# EAGLE schematic mdu29 (EAGLE 8.6.0)

## Sheet 1 of 2: logic circuit
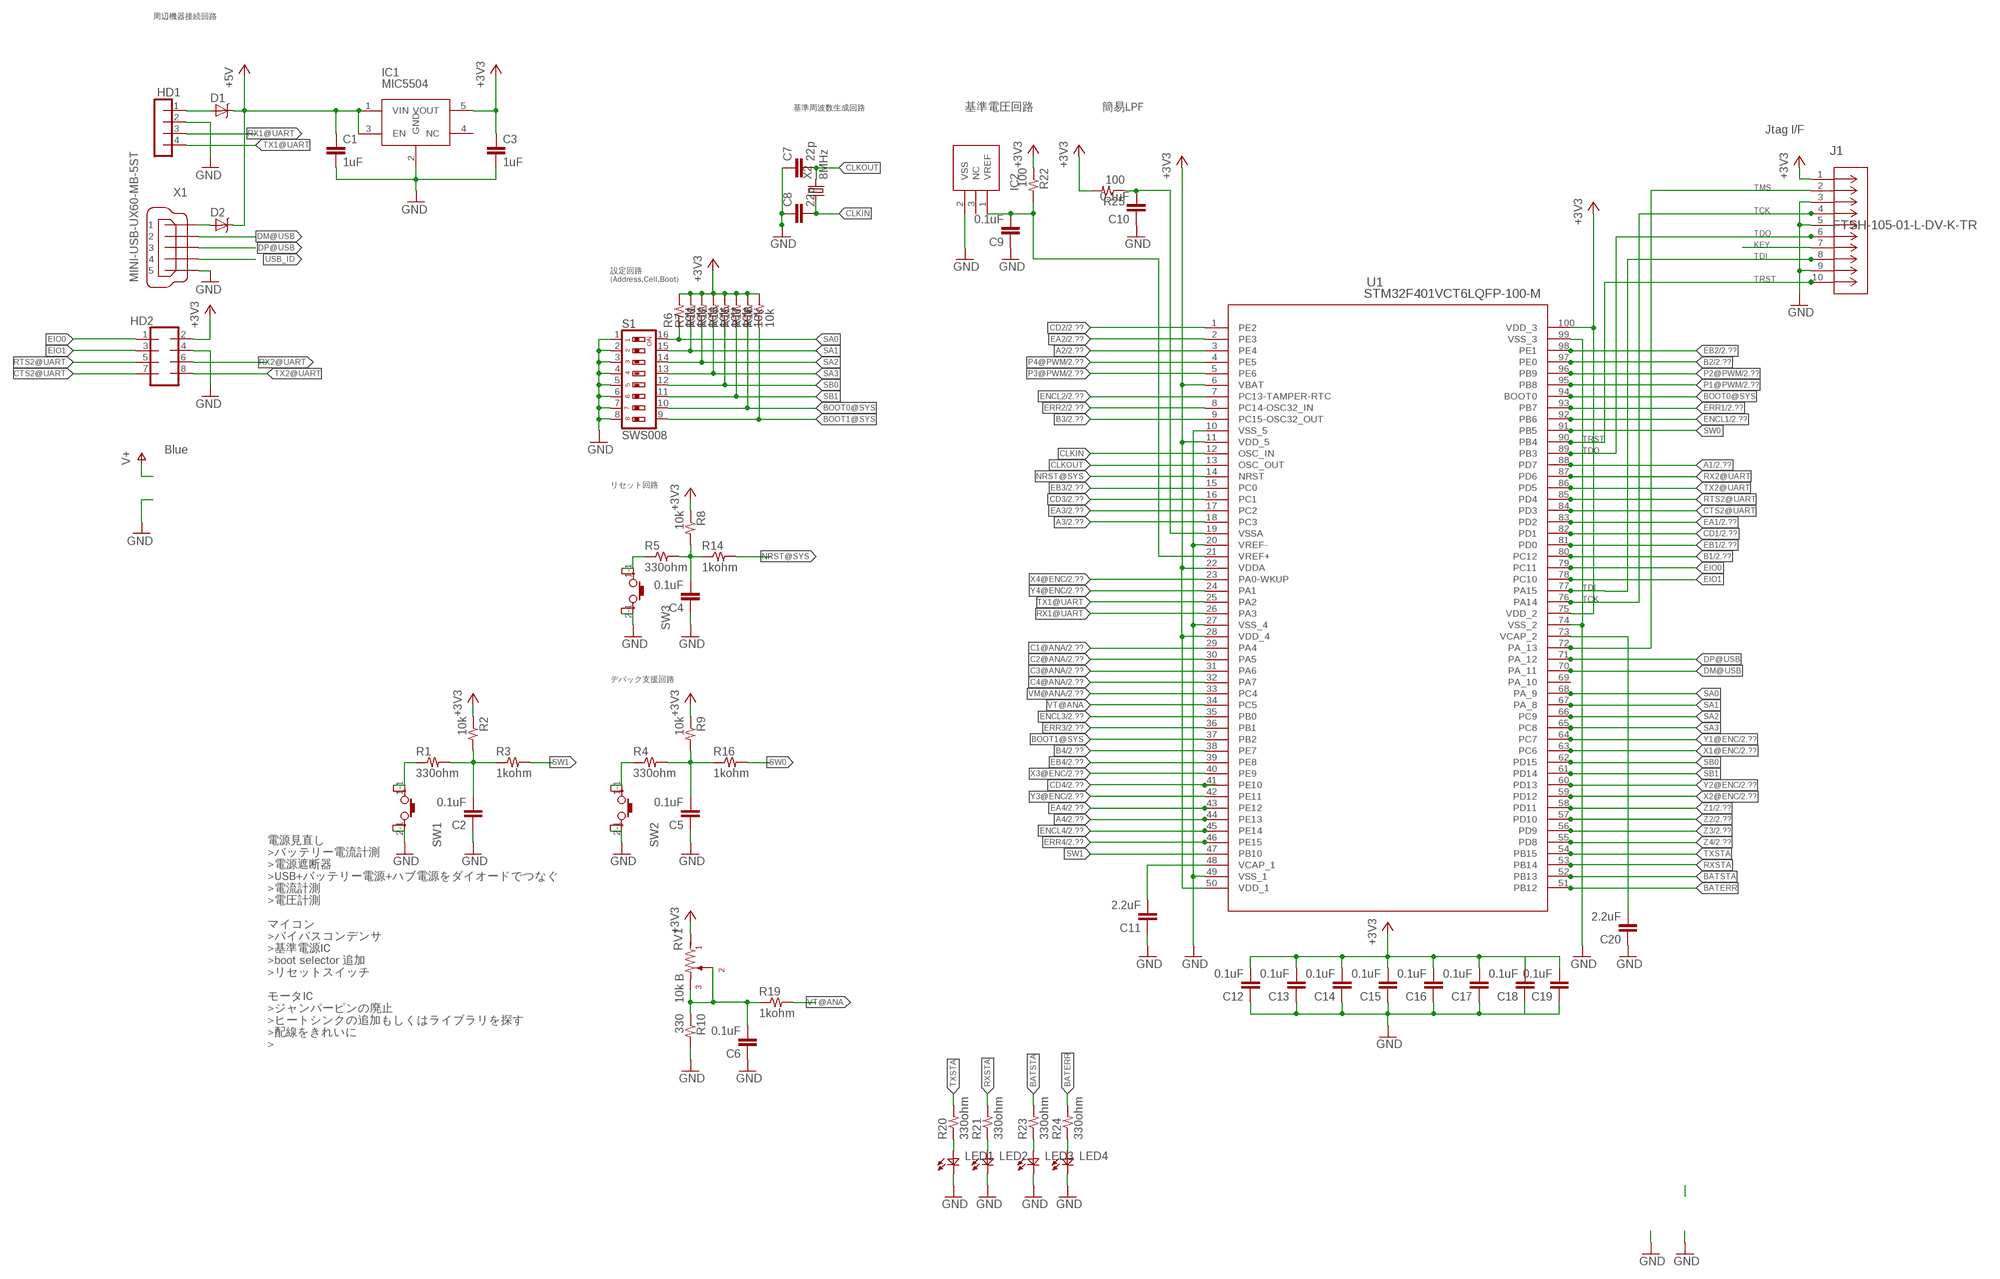
[diagram p0: schematic, sheet 1]

### Parts
C1  1uF  C1608  [1608]
C2  0.1uF  C1608  [1608]
C3  1uF  C1608  [1608]
C4  0.1uF  C1608  [1608]
C5  0.1uF  C1608  [1608]
C6  0.1uF  C1608  [1608]
C7  22p  C1608  [1608]
C8  22p  C1608  [1608]
C9  0.1uF  C1608  [1608]
C10  0.1uF  C1608  [1608]
C11  2.2uF  C1608  [1608]
C12  0.1uF  C1608  [1608]
C13  0.1uF  C1608  [1608]
C14  0.1uF  C1608  [1608]
C15  0.1uF  C1608  [1608]
C16  0.1uF  C1608  [1608]
C17  0.1uF  C1608  [1608]
C18  0.1uF  C1608  [1608]
C19  0.1uF  C1608  [1608]
C20  2.2uF  C1608  [1608]
D1  ZENER-SOD523  [SOD523]
D2  ZENER-SOD523  [SOD523]
HD1  1X4L  [1X4-L]
HD2  2X4I  [2X4-I]
IC1  MIC5504  [SOT95P270X145-5N]
IC2  LM4040  [SOT23]
J1  FTSH-105-01-L-DV-K-TR  [CON10_2X5_DUK_FTSH]
LED1  LED1608  [1608]
LED2  LED1608  [1608]
LED3  LED1608  [1608]
LED4  LED1608  [1608]
R1  330ohm  R1608  [1608]
R2  10k  R1608  [1608]
R3  1kohm  R1608  [1608]
R4  330ohm  R1608  [1608]
R5  330ohm  R1608  [1608]
R6  10k  R1608  [1608]
R7  10k  R1608  [1608]
R8  10k  R1608  [1608]
R9  10k  R1608  [1608]
R10  330  R1608  [1608]
R11  10k  R1608  [1608]
R12  10k  R1608  [1608]
R13  10k  R1608  [1608]
R14  1kohm  R1608  [1608]
R15  10k  R1608  [1608]
R16  1kohm  R1608  [1608]
R17  10k  R1608  [1608]
R18  10k  R1608  [1608]
R19  1kohm  R1608  [1608]
R20  330ohm  R1608  [1608]
R21  330ohm  R1608  [1608]
R22  100  R1608  [1608]
R23  330ohm  R1608  [1608]
R24  330ohm  R1608  [1608]
R25  100  R1608  [1608]
RV1  10k B  RV  [RV]
S1  SWS008  [SMS-008]
SW1  TACTSW1  [PUSHSW-1]
SW2  TACTSW1  [PUSHSW-1]
SW3  TACTSW1  [PUSHSW-1]
U1  STM32F401VCT6LQFP-100-M  [LQFP-100-M]
X1  MINI-USB-UX60-MB-5ST  [UX60-MB-5ST]
X2  8MHz  CRYSTALHC49S  [XTAL]

### Nets
+3V3: C3.1 C12.2 C13.2 C14.2 C15.2 C16.2 C17.2 C18.2 C19.2 HD2.2 IC1.5(VOUT) J1.1 R2.1 R6.2 R7.2 R8.1 R9.1 R11.2 R12.2 R13.2 R15.2 R17.2 R18.2 R22.1 R25.2 RV1.1 U1.6(VBAT) U1.11(VDD_5) U1.22(VDDA) U1.28(VDD_4) U1.50(VDD_1) U1.75(VDD_2) U1.100(VDD_3) ; also sheet 2
+5V [power]: C1.1 D1.K D2.K IC1.1(VIN) IC1.3(EN) ; also sheet 2
A1: U1.88(PD7) ; also sheet 2
A2: U1.3(PE4) ; also sheet 2
A3: U1.18(PC3) ; also sheet 2
A4: U1.44(PE13) ; also sheet 2
B1: U1.80(PC12) ; also sheet 2
B2: U1.97(PE0) ; also sheet 2
B3: U1.9(PC15-OSC32_OUT) ; also sheet 2
B4: U1.38(PE7) ; also sheet 2
BATERR: R24.2 U1.51(PB12)
BATSTA: R23.2 U1.52(PB13)
BOOT0@SYS: R17.1 S1.10 U1.94(BOOT0)
BOOT1@SYS: R18.1 S1.9 U1.37(PB2)
C1@ANA: U1.29(PA4) ; also sheet 2
C2@ANA: U1.30(PA5) ; also sheet 2
C3@ANA: U1.31(PA6) ; also sheet 2
C4@ANA: U1.32(PA7) ; also sheet 2
CD1: U1.82(PD1) ; also sheet 2
CD2: U1.1(PE2) ; also sheet 2
CD3: U1.16(PC1) ; also sheet 2
CD4: U1.41(PE10) ; also sheet 2
CLKIN: C8.2 U1.12(OSC_IN) X2.1
CLKOUT: C7.2 U1.13(OSC_OUT) X2.2
CTS2@UART: HD2.7 U1.84(PD3)
DM@USB: U1.70(PA_11) X1.2
DP@USB: U1.71(PA_12) X1.3
EA1: U1.83(PD2) ; also sheet 2
EA2: U1.2(PE3) ; also sheet 2
EA3: U1.17(PC2) ; also sheet 2
EA4: U1.43(PE12) ; also sheet 2
EB1: U1.81(PD0) ; also sheet 2
EB2: U1.98(PE1) ; also sheet 2
EB3: U1.15(PC0) ; also sheet 2
EB4: U1.39(PE8) ; also sheet 2
EIO0: HD2.1 U1.79(PC11)
EIO1: HD2.3 U1.78(PC10)
ENCL1: U1.92(PB6) ; also sheet 2
ENCL2: U1.7(PC13-TAMPER-RTC) ; also sheet 2
ENCL3: U1.35(PB0) ; also sheet 2
ENCL4: U1.45(PE14) ; also sheet 2
ERR1: U1.93(PB7) ; also sheet 2
ERR2: U1.8(PC14-OSC32_IN) ; also sheet 2
ERR3: U1.36(PB1) ; also sheet 2
ERR4: U1.46(PE15) ; also sheet 2
GND: C1.2 C2.1 C3.2 C4.1 C5.1 C6.1 C7.1 C8.1 C9.1 C10.1 C11.1 C12.1 C13.1 C14.1 C15.1 C16.1 C17.1 C18.1 C19.1 C20.1 HD1.2 HD2.4 IC1.2(GND) IC2.2(VSS) J1.3 J1.5 J1.9 LED1.K LED2.K LED3.K LED4.K R10.2 S1.1 S1.2 S1.3 S1.4 S1.5 S1.6 S1.7 S1.8 SW1.2-1 SW1.2-2 SW2.2-1 SW2.2-2 SW3.2-1 SW3.2-2 U1.10(VSS_5) U1.20(VREF-) U1.27(VSS_4) U1.49(VSS_1) U1.74(VSS_2) U1.99(VSS_3) X1.5 ; also sheet 2
KEY: J1.7
N$3: R4.1 SW2.1-1 SW2.1-2
N$7: R1.1 SW1.1-1 SW1.1-2
N$8: C2.2 R1.2 R2.2 R3.1
N$9: LED1.A R20.1
N$11: LED2.A R21.1
N$12: R5.1 SW3.1-1 SW3.1-2
N$13: LED3.A R23.1
N$15: LED4.A R24.1
N$20: D1.A HD1.1
N$21: C20.2 U1.73(VCAP_2)
N$23: C11.2 U1.48(VCAP_1)
N$24: C10.2 R25.1 U1.19(VSSA)
N$25: C9.2 IC2.1(VREF) R22.2 U1.21(VREF+)
N$56: C4.2 R5.2 R8.2 R14.1
N$66: C5.2 R4.2 R9.2 R16.1
N$67: C6.2 R10.1 R19.1 RV1.2 RV1.3
NRST@SYS: R14.2 U1.14(NRST)
P1@PWM: U1.95(PB8) ; also sheet 2
P2@PWM: U1.96(PB9) ; also sheet 2
P3@PWM: U1.5(PE6) ; also sheet 2
P4@PWM: U1.4(PE5) ; also sheet 2
RTS2@UART: HD2.5 U1.85(PD4)
RX1@UART: HD1.3 U1.26(PA3)
RX2@UART: HD2.6 U1.87(PD6)
RXSTA: R21.2 U1.53(PB14)
SA0: R6.1 S1.16 U1.68(PA_9)
SA1: R7.1 S1.15 U1.67(PA_8)
SA2: R11.1 S1.14 U1.66(PC9)
SA3: R12.1 S1.13 U1.65(PC8)
SB0: R13.1 S1.12 U1.62(PD15)
SB1: R15.1 S1.11 U1.61(PD14)
SW0: R16.2 U1.91(PB5)
SW1: R3.2 U1.47(PB10)
TCK: J1.4 U1.76(PA14)
TDI: J1.8 U1.77(PA15)
TDO: J1.6 U1.89(PB3)
TMS: J1.2 U1.72(PA_13)
TRST: J1.10 U1.90(PB4)
TX1@UART: HD1.4 U1.25(PA2)
TX2@UART: HD2.8 U1.86(PD5)
TXSTA: R20.2 U1.54(PB15)
USB_ID: X1.4
USB_VBUS: D2.A X1.1
VM@ANA: U1.33(PC4) ; also sheet 2
VT@ANA: R19.2 U1.34(PC5)
X1@ENC: U1.63(PC6) ; also sheet 2
X2@ENC: U1.59(PD12) ; also sheet 2
X3@ENC: U1.40(PE9) ; also sheet 2
X4@ENC: U1.23(PA0-WKUP) ; also sheet 2
Y1@ENC: U1.64(PC7) ; also sheet 2
Y2@ENC: U1.60(PD13) ; also sheet 2
Y3@ENC: U1.42(PE11) ; also sheet 2
Y4@ENC: U1.24(PA1) ; also sheet 2
Z1: U1.58(PD11) ; also sheet 2
Z2: U1.57(PD10) ; also sheet 2
Z3: U1.56(PD9) ; also sheet 2
Z4: U1.55(PD8) ; also sheet 2
Unconnected: IC1.4(NC) IC2.3(NC) U1.69(PA_10)

### Notes on the sheet
- 周辺機器接続回路
- 基準周波数生成回路 | 基準電圧回路 | 簡易LPF
- Jtag I/F
- 設定回路
  (Address,Cell,Boot)
- Blue
- リセット回路
- デバック支援回路
- 電源見直し
  >バッテリー電流計測
  >電源遮断器
  >USB+バッテリー電源+ハブ電源をダイオードでつなぐ
  >電流計測
  >電圧計測
  
  マイコン
  >バイパスコンデンサ
  >基準電源IC
  >boot selector 追加
  >リセットスイッチ
  
  モータIC
  >ジャンパーピンの廃止
  >ヒートシンクの追加もしくはライブラリを探す
  >配線をきれいに
  >

## Sheet 2 of 2: driver circuit
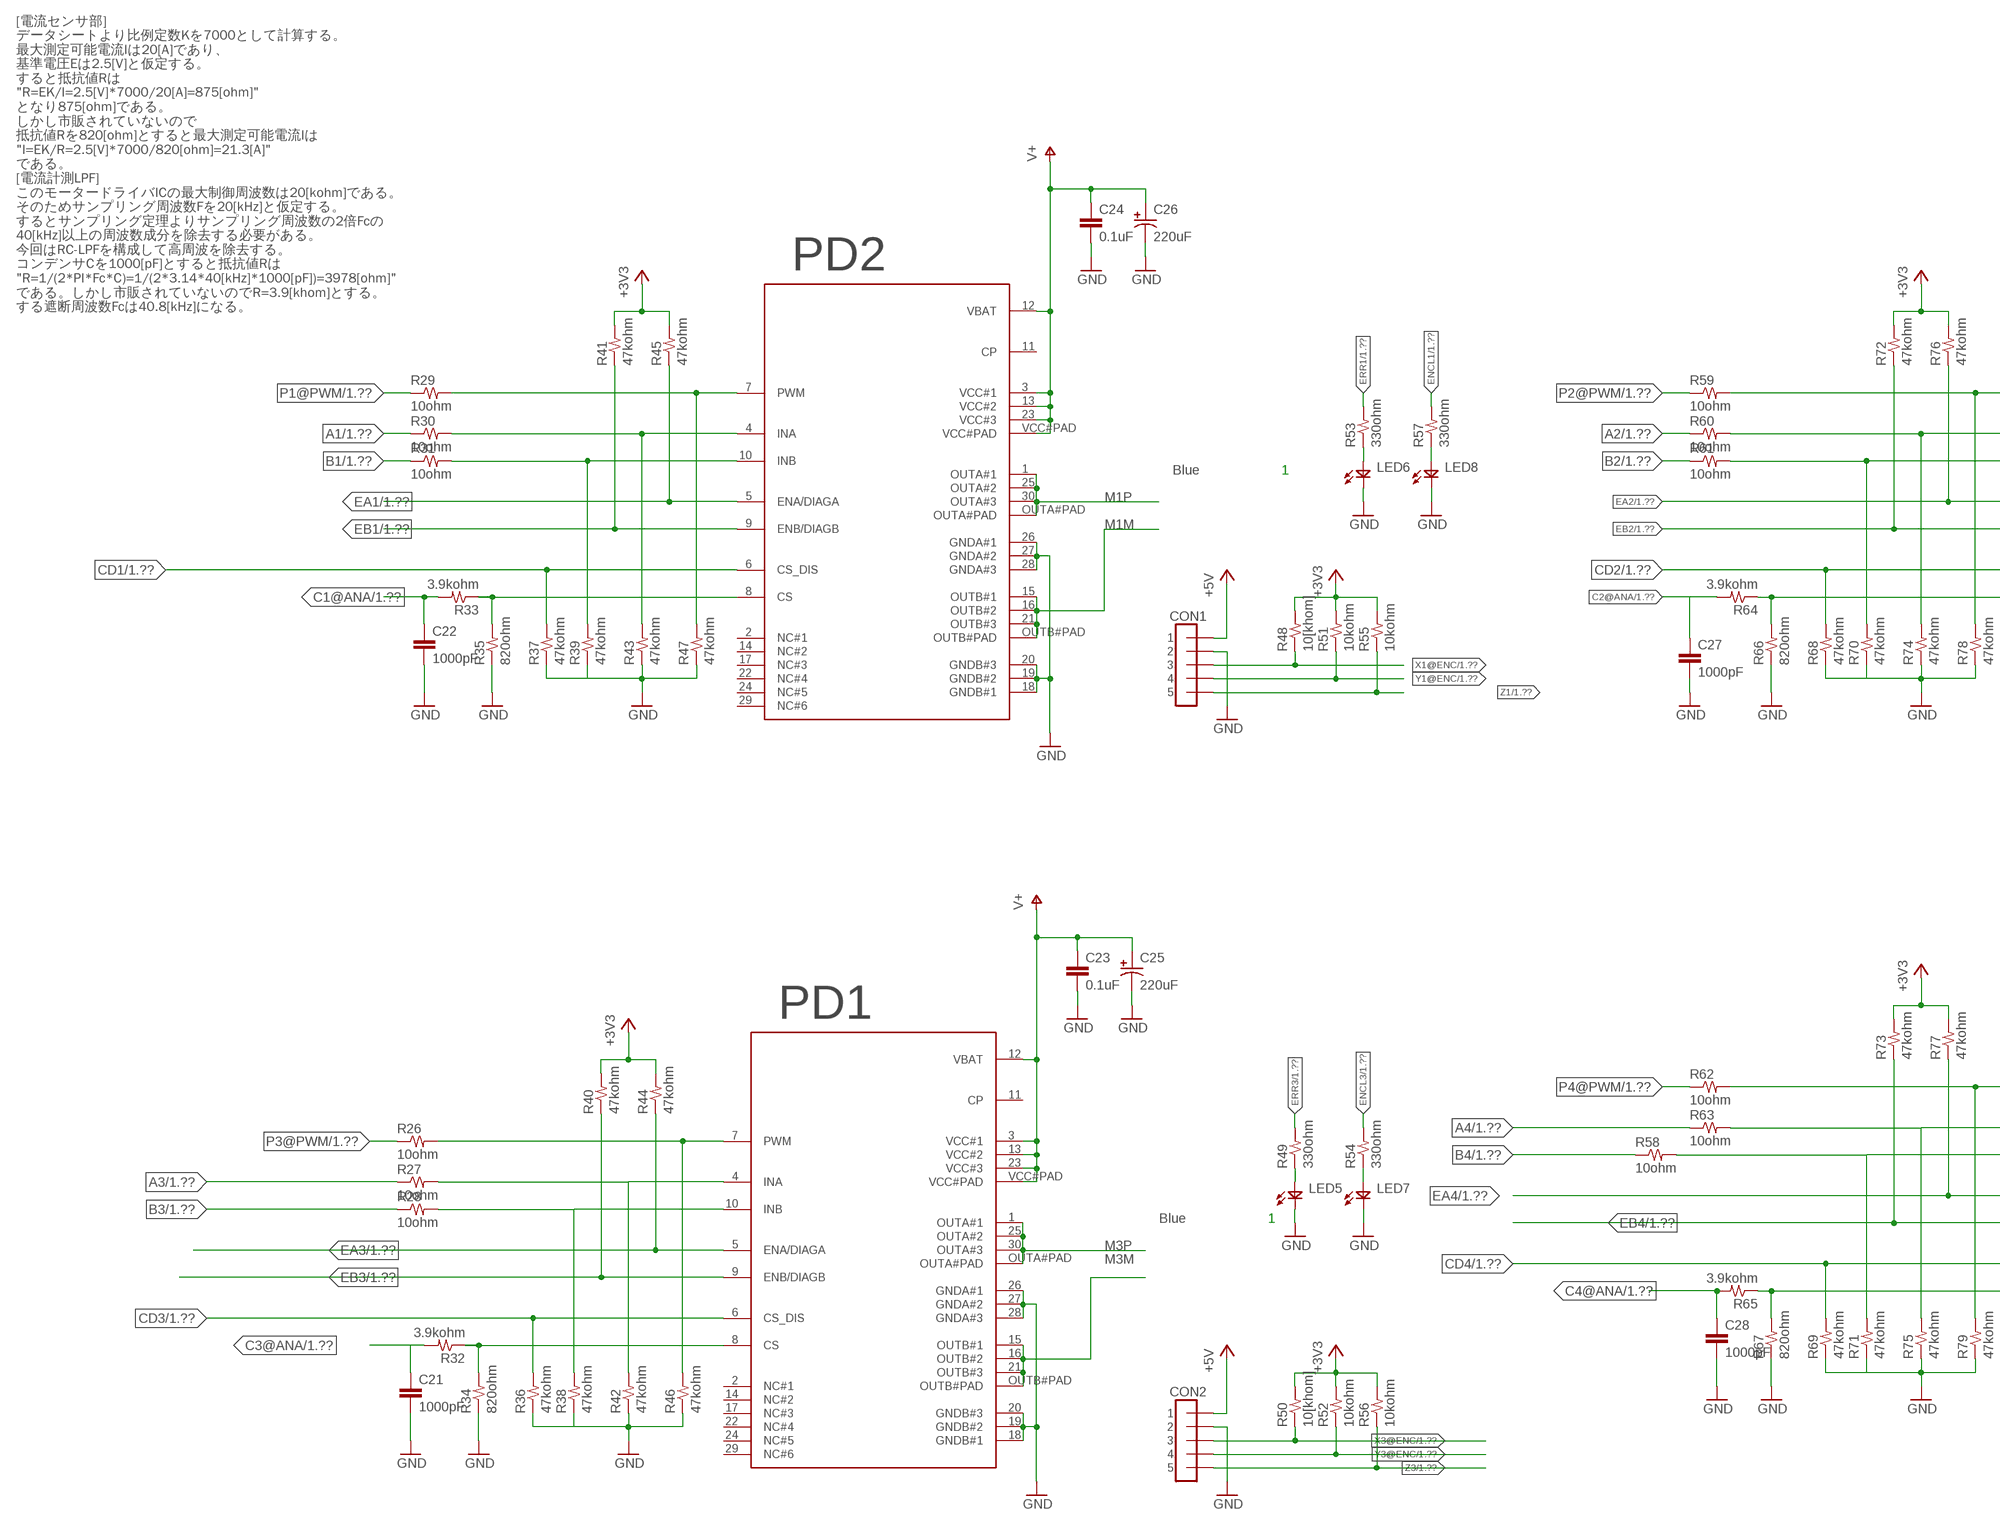
[diagram p1: schematic, sheet 2, part 1 of 2]
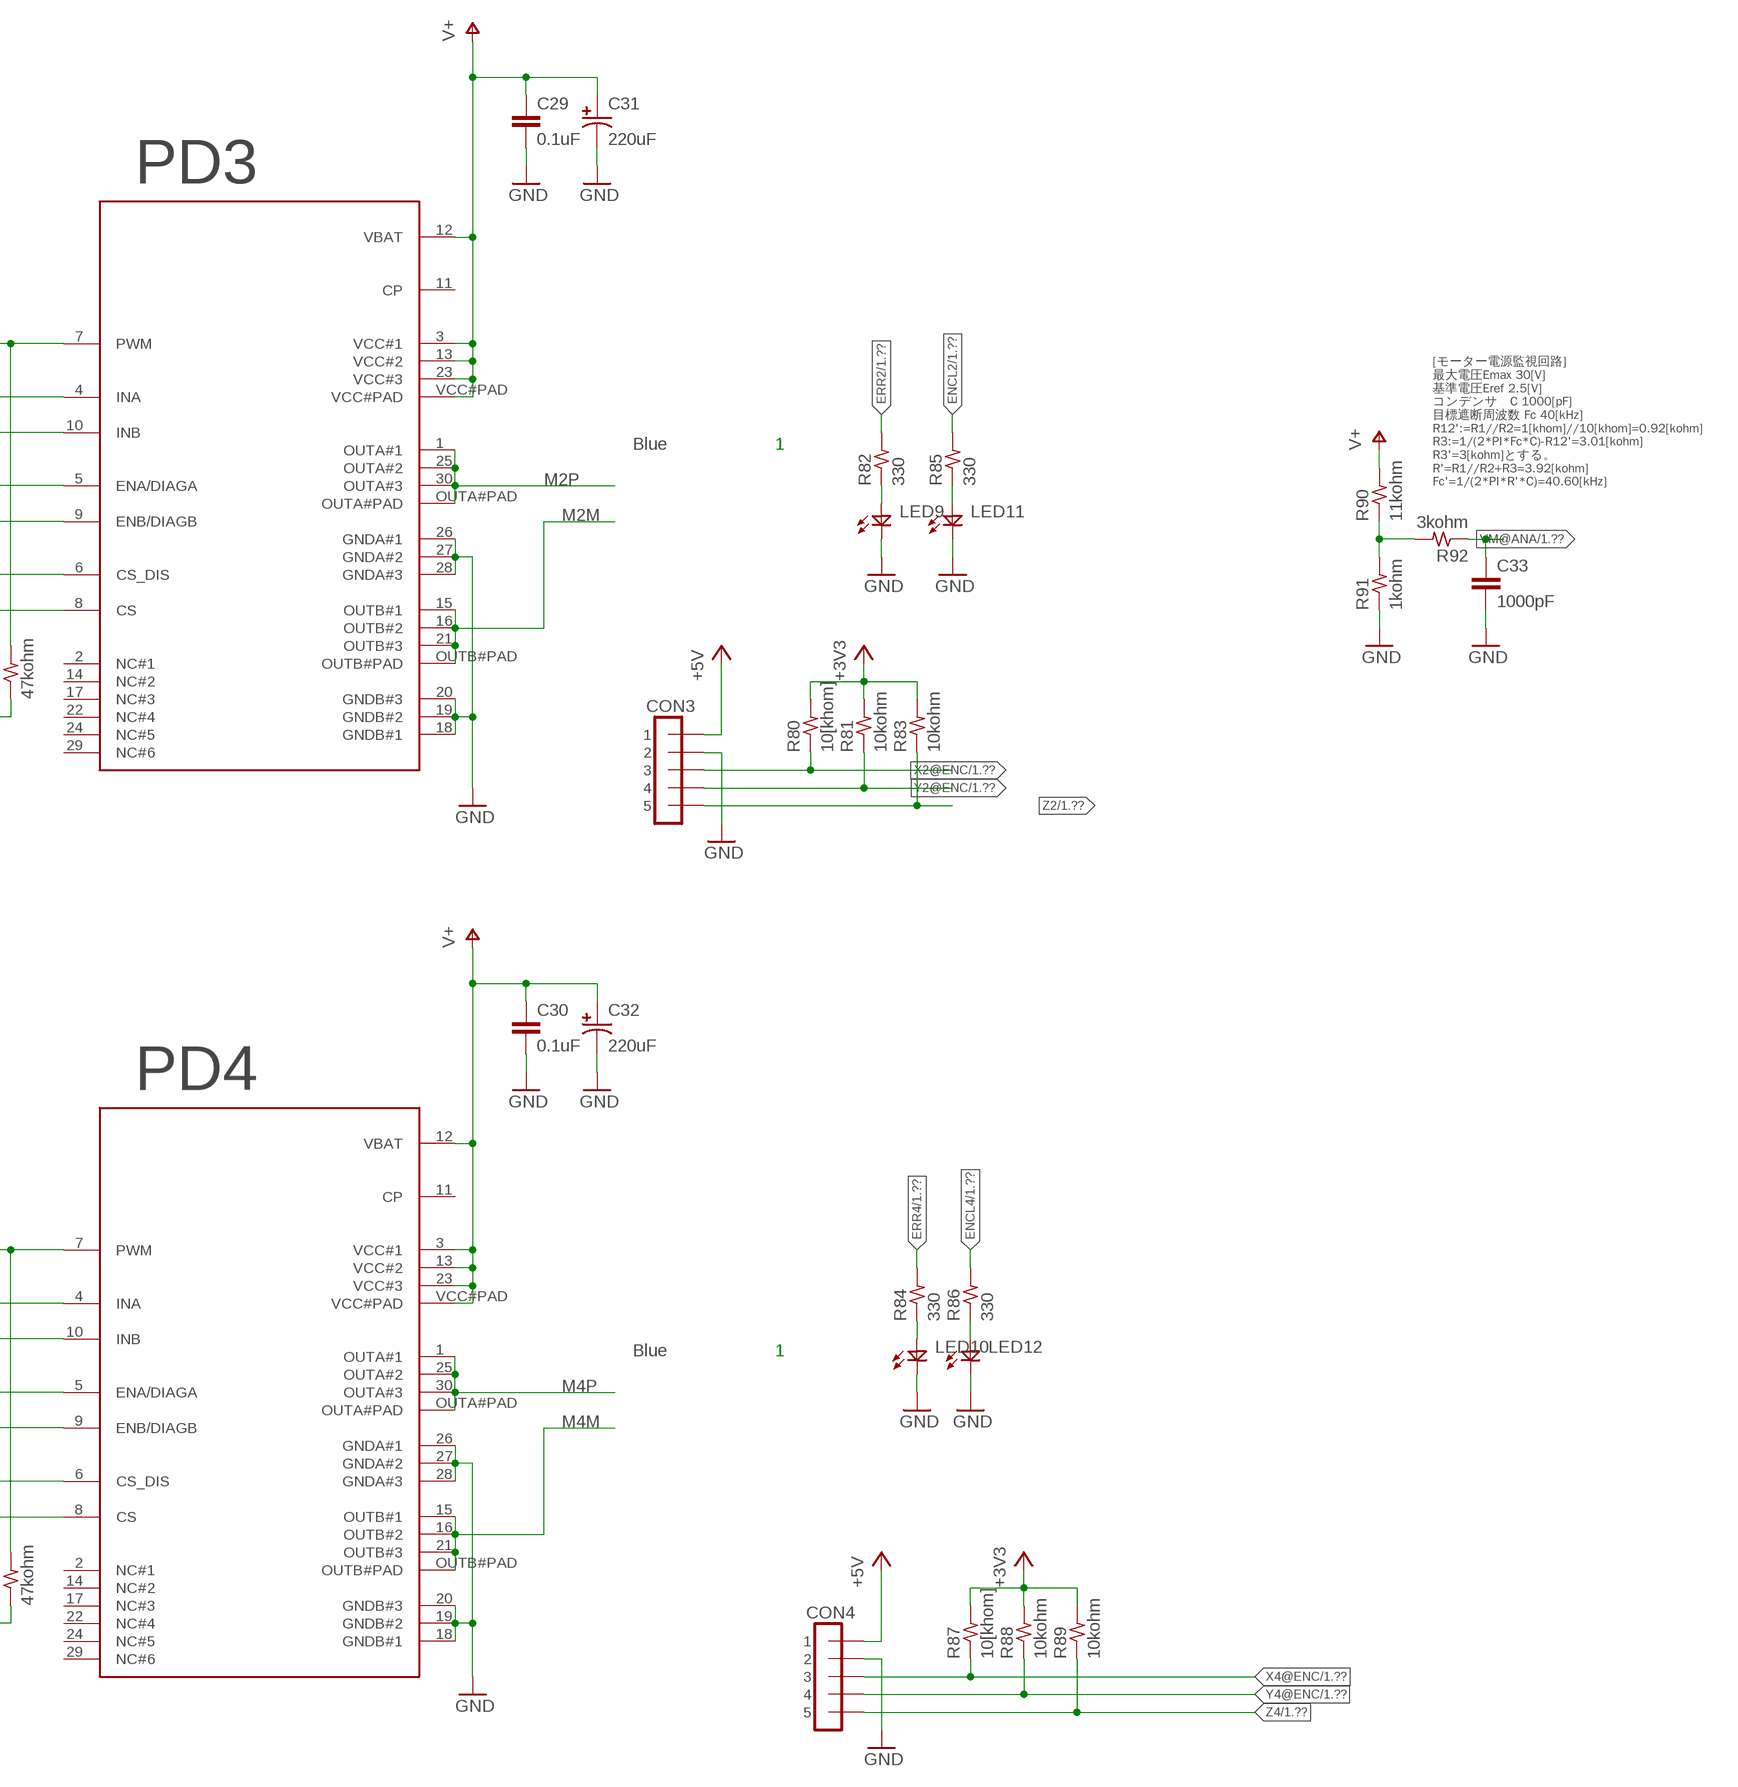
[diagram p2: schematic, sheet 2, part 2 of 2]

### Parts
C21  1000pF  C1608  [1608]
C22  1000pF  C1608  [1608]
C23  0.1uF  C1608  [1608]
C24  0.1uF  C1608  [1608]
C25  220uF  CPOLS-12.5  [ES-12.5]
C26  220uF  CPOLS-12.5  [ES-12.5]
C27  1000pF  C1608  [1608]
C28  1000pF  C1608  [1608]
C29  0.1uF  C1608  [1608]
C30  0.1uF  C1608  [1608]
C31  220uF  CPOLS-12.5  [ES-12.5]
C32  220uF  CPOLS-12.5  [ES-12.5]
C33  1000pF  C1608  [1608]
CON1  CON-5  [5-L]
CON2  CON-5  [5-L]
CON3  CON-5  [5-L]
CON4  CON-5  [5-L]
LED5  LED1608  [1608]
LED6  LED1608  [1608]
LED7  LED1608  [1608]
LED8  LED1608  [1608]
LED9  LED1608  [1608]
LED10  LED1608  [1608]
LED11  LED1608  [1608]
LED12  LED1608  [1608]
PD1  VNH5019  [VNH5019]
PD2  VNH5019  [VNH5019]
PD3  VNH5019  [VNH5019]
PD4  VNH5019  [VNH5019]
R26  10ohm  R1608  [1608]
R27  10ohm  R1608  [1608]
R28  10ohm  R1608  [1608]
R29  10ohm  R1608  [1608]
R30  10ohm  R1608  [1608]
R31  10ohm  R1608  [1608]
R32  3.9kohm  R1608  [1608]
R33  3.9kohm  R1608  [1608]
R34  820ohm  R1608  [1608]
R35  820ohm  R1608  [1608]
R36  47kohm  R1608  [1608]
R37  47kohm  R1608  [1608]
R38  47kohm  R1608  [1608]
R39  47kohm  R1608  [1608]
R40  47kohm  R1608  [1608]
R41  47kohm  R1608  [1608]
R42  47kohm  R1608  [1608]
R43  47kohm  R1608  [1608]
R44  47kohm  R1608  [1608]
R45  47kohm  R1608  [1608]
R46  47kohm  R1608  [1608]
R47  47kohm  R1608  [1608]
R48  10[khom]  R1608  [1608]
R49  330ohm  R1608  [1608]
R50  10[khom]  R1608  [1608]
R51  10kohm  R1608  [1608]
R52  10kohm  R1608  [1608]
R53  330ohm  R1608  [1608]
R54  330ohm  R1608  [1608]
R55  10kohm  R1608  [1608]
R56  10kohm  R1608  [1608]
R57  330ohm  R1608  [1608]
R58  10ohm  R1608  [1608]
R59  10ohm  R1608  [1608]
R60  10ohm  R1608  [1608]
R61  10ohm  R1608  [1608]
R62  10ohm  R1608  [1608]
R63  10ohm  R1608  [1608]
R64  3.9kohm  R1608  [1608]
R65  3.9kohm  R1608  [1608]
R66  820ohm  R1608  [1608]
R67  820ohm  R1608  [1608]
R68  47kohm  R1608  [1608]
R69  47kohm  R1608  [1608]
R70  47kohm  R1608  [1608]
R71  47kohm  R1608  [1608]
R72  47kohm  R1608  [1608]
R73  47kohm  R1608  [1608]
R74  47kohm  R1608  [1608]
R75  47kohm  R1608  [1608]
R76  47kohm  R1608  [1608]
R77  47kohm  R1608  [1608]
R78  47kohm  R1608  [1608]
R79  47kohm  R1608  [1608]
R80  10[khom]  R1608  [1608]
R81  10kohm  R1608  [1608]
R82  330  R1608  [1608]
R83  10kohm  R1608  [1608]
R84  330  R1608  [1608]
R85  330  R1608  [1608]
R86  330  R1608  [1608]
R87  10[khom]  R1608  [1608]
R88  10kohm  R1608  [1608]
R89  10kohm  R1608  [1608]
R90  11kohm  R1608  [1608]
R91  1kohm  R1608  [1608]
R92  3kohm  R1608  [1608]

### Nets
+3V3: R40.2 R41.2 R44.2 R45.2 R48.2 R50.2 R51.2 R52.2 R55.2 R56.2 R72.2 R73.2 R76.2 R77.2 R80.2 R81.2 R83.2 R87.2 R88.2 R89.2 ; also sheet 1
+5V [power]: CON1.P$1 CON2.P$1 CON3.P$1 CON4.P$1 ; also sheet 1
A1: R30.1 ; also sheet 1
A2: R60.1 ; also sheet 1
A3: R27.1 ; also sheet 1
A4: R63.1 ; also sheet 1
B1: R31.1 ; also sheet 1
B2: R61.1 ; also sheet 1
B3: R28.1 ; also sheet 1
B4: R58.1 ; also sheet 1
C1@ANA: C22.1 R33.2 ; also sheet 1
C2@ANA: C27.1 R64.2 ; also sheet 1
C3@ANA: C21.1 R32.2 ; also sheet 1
C4@ANA: C28.1 R65.2 ; also sheet 1
CD1: PD2.6(CS_DIS) R37.2 ; also sheet 1
CD2: PD3.6(CS_DIS) R68.2 ; also sheet 1
CD3: PD1.6(CS_DIS) R36.2 ; also sheet 1
CD4: PD4.6(CS_DIS) R69.2 ; also sheet 1
EA1: PD2.5(ENA/DIAGA) R45.1 ; also sheet 1
EA2: PD3.5(ENA/DIAGA) R76.1 ; also sheet 1
EA3: PD1.5(ENA/DIAGA) R44.1 ; also sheet 1
EA4: PD4.5(ENA/DIAGA) R77.1 ; also sheet 1
EB1: PD2.9(ENB/DIAGB) R41.1 ; also sheet 1
EB2: PD3.9(ENB/DIAGB) R72.1 ; also sheet 1
EB3: PD1.9(ENB/DIAGB) R40.1 ; also sheet 1
EB4: PD4.9(ENB/DIAGB) R73.1 ; also sheet 1
ENCL1: R57.2 ; also sheet 1
ENCL2: R85.2 ; also sheet 1
ENCL3: R54.2 ; also sheet 1
ENCL4: R86.2 ; also sheet 1
ERR1: R53.2 ; also sheet 1
ERR2: R82.2 ; also sheet 1
ERR3: R49.2 ; also sheet 1
ERR4: R84.2 ; also sheet 1
GND: C21.2 C22.2 C23.2 C24.2 C25.N C26.N C27.2 C28.2 C29.2 C30.2 C31.N C32.N C33.2 CON1.P$2 CON2.P$2 CON3.P$2 CON4.P$2 LED5.K LED6.K LED7.K LED8.K LED9.K LED10.K LED11.K LED12.K PD1.18(GNDB#1) PD1.19(GNDB#2) PD1.20(GNDB#3) PD1.26(GNDA#1) PD1.27(GNDA#2) PD1.28(GNDA#3) PD2.18(GNDB#1) PD2.19(GNDB#2) PD2.20(GNDB#3) PD2.26(GNDA#1) PD2.27(GNDA#2) PD2.28(GNDA#3) PD3.18(GNDB#1) PD3.19(GNDB#2) PD3.20(GNDB#3) PD3.26(GNDA#1) PD3.27(GNDA#2) PD3.28(GNDA#3) PD4.18(GNDB#1) PD4.19(GNDB#2) PD4.20(GNDB#3) PD4.26(GNDA#1) PD4.27(GNDA#2) PD4.28(GNDA#3) R34.1 R35.1 R36.1 R37.1 R38.1 R39.1 R42.1 R43.1 R46.1 R47.1 R66.1 R67.1 R68.1 R69.1 R70.1 R71.1 R74.1 R75.1 R78.1 R79.1 R91.1 ; also sheet 1
M1M [strong]: PD2.15(OUTB#1) PD2.16(OUTB#2) PD2.21(OUTB#3) PD2.OUTB#PAD
M1P [strong]: PD2.1(OUTA#1) PD2.25(OUTA#2) PD2.30(OUTA#3) PD2.OUTA#PAD
M2M [strong]: PD3.15(OUTB#1) PD3.16(OUTB#2) PD3.21(OUTB#3) PD3.OUTB#PAD
M2P [strong]: PD3.1(OUTA#1) PD3.25(OUTA#2) PD3.30(OUTA#3) PD3.OUTA#PAD
M3M [strong]: PD1.15(OUTB#1) PD1.16(OUTB#2) PD1.21(OUTB#3) PD1.OUTB#PAD
M3P [strong]: PD1.1(OUTA#1) PD1.25(OUTA#2) PD1.30(OUTA#3) PD1.OUTA#PAD
M4M [strong]: PD4.15(OUTB#1) PD4.16(OUTB#2) PD4.21(OUTB#3) PD4.OUTB#PAD
M4P [strong]: PD4.1(OUTA#1) PD4.25(OUTA#2) PD4.30(OUTA#3) PD4.OUTA#PAD
N$1: LED6.A R53.1
N$2: LED9.A R82.1
N$4: LED8.A R57.1
N$5: LED5.A R49.1
N$6: LED10.A R84.1
N$14: LED11.A R85.1
N$16: LED12.A R86.1
N$18: LED7.A R54.1
N$19: R90.1 R91.2 R92.2
N$26: PD2.7(PWM) R29.2 R47.2
N$29: PD3.7(PWM) R59.2 R78.2
N$30: PD3.4(INA) R60.2 R74.2
N$31: PD3.10(INB) R61.2 R70.2
N$32: PD3.8(CS) R64.1 R66.2
N$35: PD1.7(PWM) R26.2 R46.2
N$36: PD1.4(INA) R27.2 R42.2
N$37: PD1.10(INB) R28.2 R38.2
N$38: PD2.4(INA) R30.2 R43.2
N$39: PD2.10(INB) R31.2 R39.2
N$40: PD1.8(CS) R32.1 R34.2
N$43: PD4.7(PWM) R62.2 R79.2
N$44: PD4.4(INA) R63.2 R75.2
N$45: PD4.10(INB) R58.2 R71.2
N$46: PD4.8(CS) R65.1 R67.2
N$52: PD2.8(CS) R33.1 R35.2
P1@PWM: R29.1 ; also sheet 1
P2@PWM: R59.1 ; also sheet 1
P3@PWM: R26.1 ; also sheet 1
P4@PWM: R62.1 ; also sheet 1
V+ [strong]: C23.1 C24.1 C25.P C26.P C29.1 C30.1 C31.P C32.P PD1.3(VCC#1) PD1.12(VBAT) PD1.13(VCC#2) PD1.23(VCC#3) PD1.VCC#PAD PD2.3(VCC#1) PD2.12(VBAT) PD2.13(VCC#2) PD2.23(VCC#3) PD2.VCC#PAD PD3.3(VCC#1) PD3.12(VBAT) PD3.13(VCC#2) PD3.23(VCC#3) PD3.VCC#PAD PD4.3(VCC#1) PD4.12(VBAT) PD4.13(VCC#2) PD4.23(VCC#3) PD4.VCC#PAD R90.2 ; also sheet 1
VM@ANA: C33.1 R92.1 ; also sheet 1
X1@ENC: CON1.P$3 R48.1 ; also sheet 1
X2@ENC: CON3.P$3 R80.1 ; also sheet 1
X3@ENC: CON2.P$3 R50.1 ; also sheet 1
X4@ENC: CON4.P$3 R87.1 ; also sheet 1
Y1@ENC: CON1.P$4 R51.1 ; also sheet 1
Y2@ENC: CON3.P$4 R81.1 ; also sheet 1
Y3@ENC: CON2.P$4 R52.1 ; also sheet 1
Y4@ENC: CON4.P$4 R88.1 ; also sheet 1
Z1: CON1.P$5 R55.1 ; also sheet 1
Z2: CON3.P$5 R83.1 ; also sheet 1
Z3: CON2.P$5 R56.1 ; also sheet 1
Z4: CON4.P$5 R89.1 ; also sheet 1
Unconnected: PD1.2(NC#1) PD1.11(CP) PD1.14(NC#2) PD1.17(NC#3) PD1.22(NC#4) PD1.24(NC#5) PD1.29(NC#6) PD2.2(NC#1) PD2.11(CP) PD2.14(NC#2) PD2.17(NC#3) PD2.22(NC#4) PD2.24(NC#5) PD2.29(NC#6) PD3.2(NC#1) PD3.11(CP) PD3.14(NC#2) PD3.17(NC#3) PD3.22(NC#4) PD3.24(NC#5) PD3.29(NC#6) PD4.2(NC#1) PD4.11(CP) PD4.14(NC#2) PD4.17(NC#3) PD4.22(NC#4) PD4.24(NC#5) PD4.29(NC#6)

### Notes on the sheet
- [電流センサ部]
  データシートより比例定数Kを7000として計算する。
  最大測定可能電流Iは20[A]であり、
  基準電圧Eは2.5[V]と仮定する。
  すると抵抗値Rは
  "R=EK/I=2.5[V]*7000/20[A]=875[ohm]"
  となり875[ohm]である。
  しかし市販されていないので
  抵抗値Rを820[ohm]とすると最大測定可能電流Iは
  "I=EK/R=2.5[V]*7000/820[ohm]=21.3[A]"
  である。
  [電流計測LPF]
  このモータードライバICの最大制御周波数は20[kohm]である。
  そのためサンプリング周波数Fを20[kHz]と仮定する。
  するとサンプリング定理よりサンプリング周波数の2倍Fcの
  40[kHz]以上の周波数成分を除去する必要がある。
  今回はRC-LPFを構成して高周波を除去する。
  コンデンサCを1000[pF]とすると抵抗値Rは
  "R=1/(2*PI*Fc*C)=1/(2*3.14*40[kHz]*1000[pF])=3978[ohm]"
  である。しかし市販されていないのでR=3.9[khom]とする。
  する遮断周波数Fcは40.8[kHz]になる。
- Blue | 1 | Blue | 1
- [モーター電源監視回路]
  最大電圧Emax 30[V]
  基準電圧Eref 2.5[V]
  コンデンサ　C 1000[pF]
  目標遮断周波数 Fc 40[kHz]
  R12':=R1//R2=1[khom]//10[khom]=0.92[kohm]
  R3:=1/(2*PI*Fc*C)-R12'=3.01[kohm]
  R3'=3[kohm]とする。
  R'=R1//R2+R3=3.92[kohm]
  Fc'=1/(2*PI*R'*C)=40.60[kHz]
- Blue | 1
- Blue | 1

## Library data of the parts
C1-C24 C27-C30 C33 = Passive:C
C25 C26 C31 C32 = Passive:CPOL
CON1-CON4 = _connecter:CON-5
D1 D2 = diode:ZENER-*
HD1 = _pinheader:1X4: PIN HEADER
HD2 = _pinheader:2X4: PIN HEADER
IC1 = PMIC:MIC5504
IC2 = PMIC:LM4040
J1 = MDULib:FTSH-105-01-L-DV-K-TR; CATEGORY: Connectors; COLOR: Black; CONNECTORTYPE: Header, Unshrouded; CONTACTFINISH: Gold; CONTACTFINISHTHICKNESS: 10µin (0.25µm); CONTACTMATINGLENGTH: 0.120" (3.05mm); CONTACTTYPE: Male Pin; COPYRIGHT: Copyright (C) 2015 Accelerated Designs. All rights reserved; DATASHEET: http://www.samtec.com/documents/webfiles/pdf/FTSH_SMT.pdf; DIGIKEYPARTNUMBER: FTSH-105-01-L-DV-K-TR-ND; FASTENINGTYPE: -; FEATURES: -; MANUFACTURER_PART_NUMBER: FTSH-105-01-L-DV-K-TR; MOUNTINGTYPE: Surface Mount; NUMBEROFPOSITIONS: 10; NUMBEROFPOSITIONSLOADED: All; NUMBEROFROWS: 2; PACKAGING: Tape &amp Reel (TR); PITCH: 0.050" (1.27mm); QUANTITY_AVAILABLE: 0; ROWSPACING: 0.050" (1.27mm); TERMINATION: Solder; VENDOR: Samtec Inc
LED1-LED12 = Opto:LED
PD1-PD4 = MDULib:VNH5019
R1-R92 = Passive:R
RV1 = _RC:RV
S1 = smd-special:SWS008: SMD Dip Switch 8 pol.
SW1-SW3 = _switch:TACTSW
U1 = STMChip:STM32F401VCT6; MANUFACTURER_PART_NUMBER: STM32F401VCT6; VENDOR: ST Microelectronics
X1 = con-hirose:MINI-USB-: MINI USB Connector Source: http://www.hirose.co.jp/cataloge_hp/e24000019.pdf; OC_FARNELL: unknown; OC_NEWARK: unknown
X2 = _others:CRYSTAL: CRYSTAL; OC_FARNELL: 1667008; OC_NEWARK: unknown

## Net classes
1 power: width 0.305 mm, drill 0.6 mm
2 strong: width 0.406 mm, clearance 0.254 mm